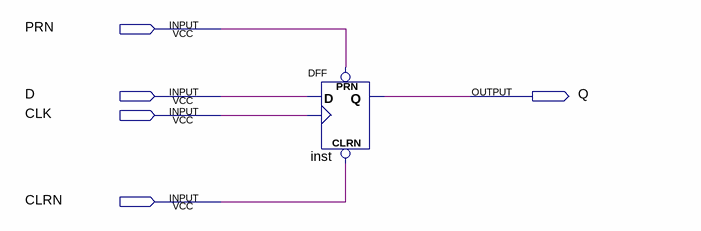
[diagram p0: schematic sheet]
// Quartus schematic D-flipflopDiagram.bdf as structural Verilog: 1 symbols, 5 pins
module \D-flipflopDiagram  (
  input  PRN,
  input  D,
  input  CLK,
  input  CLRN,
  output Q
);

  DFF inst (.CLRN(CLRN), .CLK(CLK), .D(D), .PRN(PRN), .Q(Q));
endmodule
